# Altium schematic sheet SubBus15.SchDoc
size A
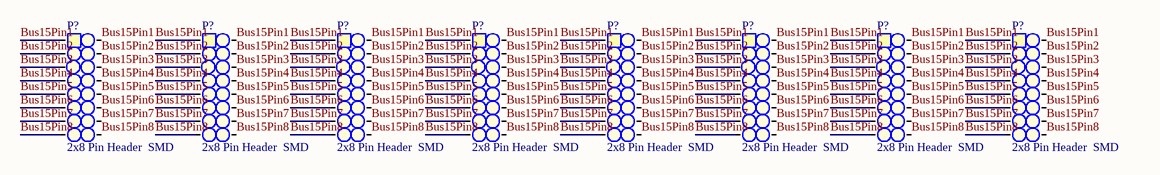
[diagram p0: SubBus15.SchDoc]

## Parts
(Parts that share a designator on the sheet are numbered #1, #2 ... from top to bottom, then left to right.)
P?#1  2x8 Pin Header  SMD  [2X8_SMD_PH_2.54]
P?#2  2x8 Pin Header  SMD  [2X8_SMD_PH_2.54]
P?#3  2x8 Pin Header  SMD  [2X8_SMD_PH_2.54]
P?#4  2x8 Pin Header  SMD  [2X8_SMD_PH_2.54]
P?#5  2x8 Pin Header  SMD  [2X8_SMD_PH_2.54]
P?#6  2x8 Pin Header  SMD  [2X8_SMD_PH_2.54]
P?#7  2x8 Pin Header  SMD  [2X8_SMD_PH_2.54]
P?#8  2x8 Pin Header  SMD  [2X8_SMD_PH_2.54]

## Nets
Bus15Pin1: P?#1.1 P?#1.16 P?#2.1 P?#2.16 P?#3.1 P?#3.16 P?#4.1 P?#4.16 P?#5.1 P?#5.16 P?#6.1 P?#6.16 P?#7.1 P?#7.16 P?#8.1 P?#8.16
Bus15Pin2: P?#1.2 P?#1.15 P?#2.2 P?#2.15 P?#3.2 P?#3.15 P?#4.2 P?#4.15 P?#5.2 P?#5.15 P?#6.2 P?#6.15 P?#7.2 P?#7.15 P?#8.2 P?#8.15
Bus15Pin3: P?#1.3 P?#1.14 P?#2.3 P?#2.14 P?#3.3 P?#3.14 P?#4.3 P?#4.14 P?#5.3 P?#5.14 P?#6.3 P?#6.14 P?#7.3 P?#7.14 P?#8.3 P?#8.14
Bus15Pin4: P?#1.4 P?#1.13 P?#2.4 P?#2.13 P?#3.4 P?#3.13 P?#4.4 P?#4.13 P?#5.4 P?#5.13 P?#6.4 P?#6.13 P?#7.4 P?#7.13 P?#8.4 P?#8.13
Bus15Pin5: P?#1.5 P?#1.12 P?#2.5 P?#2.12 P?#3.5 P?#3.12 P?#4.5 P?#4.12 P?#5.5 P?#5.12 P?#6.5 P?#6.12 P?#7.5 P?#7.12 P?#8.5 P?#8.12
Bus15Pin6: P?#1.6 P?#1.11 P?#2.6 P?#2.11 P?#3.6 P?#3.11 P?#4.6 P?#4.11 P?#5.6 P?#5.11 P?#6.6 P?#6.11 P?#7.6 P?#7.11 P?#8.6 P?#8.11
Bus15Pin7: P?#1.7 P?#1.10 P?#2.7 P?#2.10 P?#3.7 P?#3.10 P?#4.7 P?#4.10 P?#5.7 P?#5.10 P?#6.7 P?#6.10 P?#7.7 P?#7.10 P?#8.7 P?#8.10
Bus15Pin8: P?#1.8 P?#1.9 P?#2.8 P?#2.9 P?#3.8 P?#3.9 P?#4.8 P?#4.9 P?#5.8 P?#5.9 P?#6.8 P?#6.9 P?#7.8 P?#7.9 P?#8.8 P?#8.9

## Library data of the parts
P?#1-P?#8 = 2x8 Pin Header  SMD: 2.54mm, SMD; Value: 2x8 Pin Header, 2.54mm, SMD; Farnell: 2356242